# EAGLE design BMX055 Breakout (EAGLE 6.6.0)
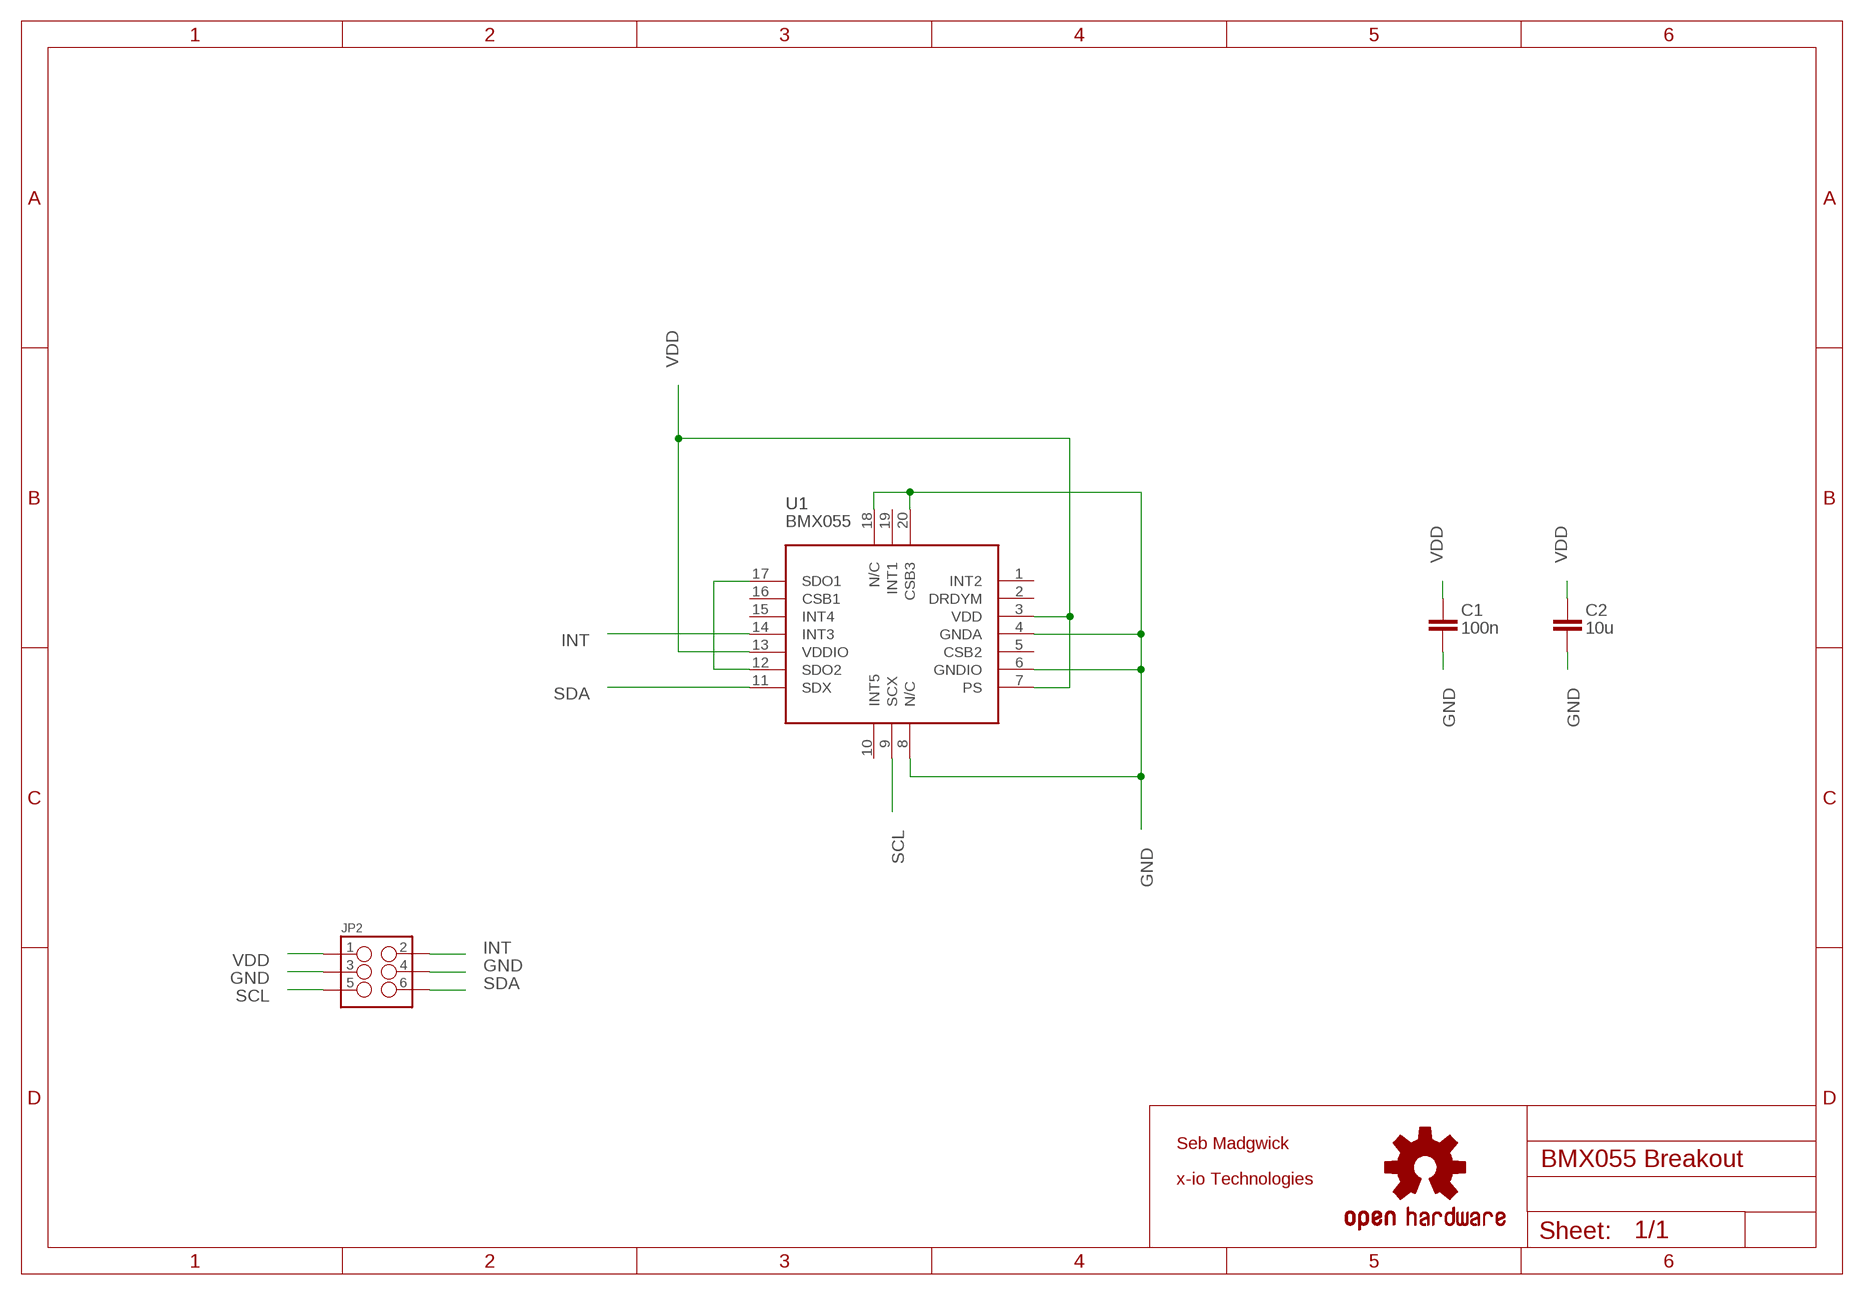
[diagram p0: schematic, sheet 1]

## Parts
C1  100n  CAP0603-CAP  [0603-CAP]
C2  10u  CAP0603-CAP  [0603-CAP]
JP2  M03X2POGO_PINS  [2X3_POGO]
LOGO1  OSHW-LOGOS  [OSHW-LOGO-S]
U1  BMX055  [BMX055]

## Nets
GND: C1.2 C2.2 JP2.P$3 JP2.P$4 U1.4(GNDA) U1.6(GNDIO) U1.8(N/C) U1.18(N/C) U1.20(CSB3)
INT: JP2.P$2 U1.14(INT3)
N$1: U1.12(SDO2) U1.17(SDO1)
SCL: JP2.P$5 U1.9(SCX)
SDA: JP2.P$6 U1.11(SDX)
VDD: C1.1 C2.1 JP2.P$1 U1.3(VDD) U1.7(PS) U1.13(VDDIO)
Unconnected: U1.1(INT2) U1.2(DRDYM) U1.5(CSB2) U1.10(INT5) U1.15(INT4) U1.16(CSB1) U1.19(INT1)

## Notes on the sheet
- Seb Madgwick
- x-io Technologies

## Library data of the parts
C1 C2 = SparkFun-Capacitors:CAP: Capacitor Standard 0603 ceramic capacitor, and 0.1" leaded capacitor.
JP2 = SparkFun-Connectors:M03X2: 2x3 .1" header. Shrouded, with keying- CONN-10681 SMT- CONN-11415 Pogo pins- HW-11044; PROD_ID: HW-11044
LOGO1 = SparkFun-Aesthetics:OSHW-LOGO: Open Source Hardware Logo This logo indicates the piece of hardware it is found on incorporates a OSHW license and/or adheres to the definition of open source hardware found here: http://freedomdefined.org/OSHW
U1 = x-io:BMX055

## Board
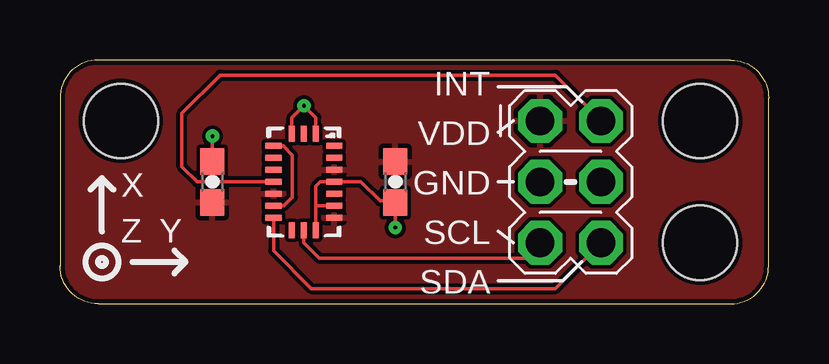
[diagram p1: board, top side]
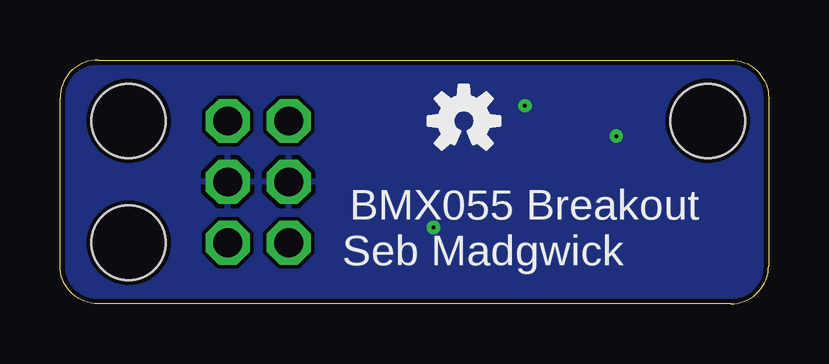
[diagram p2: board, bottom side, seen from below]

Size 29.53 x 10.16 mm. Coordinates in mm from the lower left corner, seen from the top.
Outline: 1.59,0 27.94,0 arc90 29.53,1.59 29.53,8.57 arc90 27.94,10.16 1.59,10.16 arc90 0,8.57 0,1.59 arc90 1.59,0
Copper layers (1*16): Top 0.035mm / dielectric 1.5mm / Bottom 0.035mm
Design rules "default *": minimum track width 6mil, minimum drill 13mil, track to track 6mil, track to pad 6mil, pad to pad 6mil, via to via 6mil, smd to smd 0.15mm, copper to edge 0.2mm, drill to drill 0.15mm, minimum pad ring 10mil, minimum via ring 8mil, stop-mask expansion 4mil, vias tented up to drill 1mm, thermal gap 0.195mm
Holes 3.1 mm at 2.54,7.62 26.67,7.62 26.67,2.54

### Footprints (pad centres in the part's own frame; a part is rotated, then mirrored left to right if it is on the bottom)
0603-CAP = smd 1.1 x 1: 1 -0.85,0; 2 0.85,0
2X3_POGO = drill 1.2 pad 1.829 octagon: P$1 0,0; P$2 0,2.54; P$3 2.54,0; P$4 2.54,2.54; P$5 5.08,0; P$6 5.08,2.54
BMX055 = smd 0.675 x 0.25: 1 1.262,1.5; 2 1.262,1; 3 1.262,0.5; 4 1.262,0; 5 1.262,-0.5; 6 1.262,-1; 7 1.262,-1.5; 11 -1.262,-1.5; 12 -1.262,-1; 13 -1.262,-0.5; 14 -1.262,0; 15 -1.262,0.5; 16 -1.262,1; 17 -1.262,1.5 | smd 0.25 x 0.675: 8 0.5,-2.013; 9 0,-2.013; 10 -0.5,-2.013; 18 -0.5,2.013; 19 0,2.013; 20 0.5,2.013

### Placement (x,y rotation side)
C1  13.97,5.08 270 top
C2  6.35,5.08 90 top
JP2  20,7.62 270 top
LOGO1  12.7,7.62 0 bottom
U1  10.16,5.08 0 top

### Tracks (layer width: path | path; a pad name or v marks a point on that pad's centre or on a via)
GND  (via drill 0.15)
  Top 0.152: 13.82,4.08 C1.2 | v13.97,3.17 C1.2 | v6.35,6.99 C2.2 | U1.18 9.66,7.75 v10.16,8.26 10.66,7.75 U1.20 | U1.8 10.66,4.13 | 10.66,4.13 10.66,4.9 10.84,5.08 U1.4 12.54,5.08 13.34,4.29 13.91,4.29 C1.2 | U1.6 10.71,4.08 10.66,4.13
  pour Bottom: 0,10.16 29.53,10.16 29.53,0 0,0
INT
  Top 0.152: U1.14 5.71,5.08 5.08,5.71 5.08,7.94 6.67,9.53 20.64,9.53 JP2.P$2
N$1
  Top 0.152: U1.17 9.29,6.58 9.68,6.19 9.68,4.45 9.32,4.08 U1.12
SCL
  Top 0.152: U1.9 10.16,2.54 10.79,1.91 19.37,1.91 JP2.P$5
SDA
  Top 0.152: U1.11 8.9,2.21 10.48,0.64 20.64,0.64 JP2.P$6
VDD
  pour Top: 0.01,10.13 29.53,10.16 29.53,0 0,0

### Text on the board
_tsilk: INT | VDD | GND | X | Z | Y | SCL | SDA
_bsilk: BMX055 Breakout | Seb Madgwick